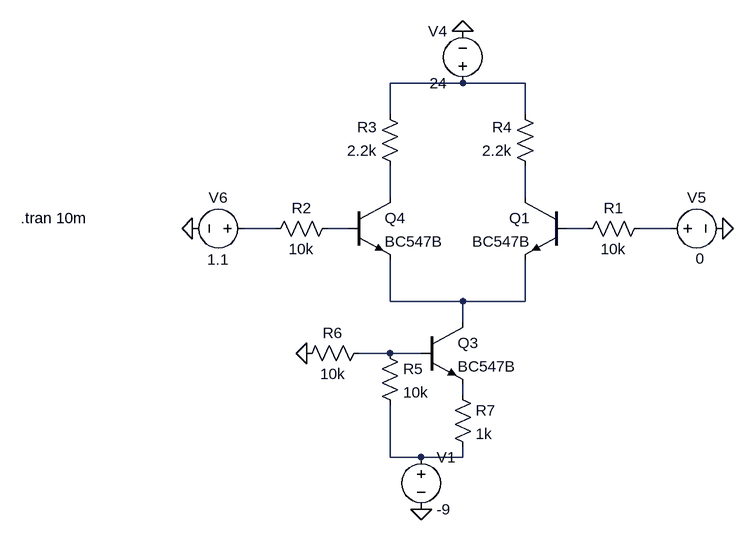
[diagram p0: schematic bjtDiffAmp.asc]
bjtDiffAmp.asc, the LTspice schematic file:
Version 4
SHEET 1 4284 2692
WIRE 3360 2016 3248 2016
WIRE 3456 2016 3360 2016
WIRE 3248 2064 3248 2016
WIRE 3456 2064 3456 2016
WIRE 3248 2192 3248 2144
WIRE 3456 2192 3456 2144
WIRE 3072 2240 3024 2240
WIRE 3184 2240 3152 2240
WIRE 3552 2240 3520 2240
WIRE 3680 2240 3632 2240
WIRE 3248 2352 3248 2288
WIRE 3360 2352 3248 2352
WIRE 3456 2352 3456 2288
WIRE 3456 2352 3360 2352
WIRE 3360 2384 3360 2352
WIRE 3248 2432 3200 2432
WIRE 3296 2432 3248 2432
WIRE 3360 2496 3360 2480
WIRE 3248 2592 3248 2512
WIRE 3296 2592 3248 2592
WIRE 3360 2592 3360 2576
WIRE 3360 2592 3296 2592
FLAG 3360 1936 0
FLAG 3760 2240 0
FLAG 3296 2672 0
FLAG 2944 2240 0
FLAG 3120 2432 0
SYMBOL res 3648 2224 R90
WINDOW 0 0 56 VBottom 2
WINDOW 3 32 56 VTop 2
SYMATTR InstName R1
SYMATTR Value 10k
SYMBOL res 3168 2224 R90
WINDOW 0 0 56 VBottom 2
WINDOW 3 32 56 VTop 2
SYMATTR InstName R2
SYMATTR Value 10k
SYMBOL res 3264 2160 R180
WINDOW 0 36 76 Left 2
WINDOW 3 36 40 Left 2
SYMATTR InstName R3
SYMATTR Value 2.2k
SYMBOL res 3472 2160 R180
WINDOW 0 36 76 Left 2
WINDOW 3 36 40 Left 2
SYMATTR InstName R4
SYMATTR Value 2.2k
SYMBOL npn 3296 2384 R0
SYMATTR InstName Q3
SYMATTR Value BC547B
SYMBOL res 3232 2416 R0
SYMATTR InstName R5
SYMATTR Value 10k
SYMBOL res 3216 2416 R90
WINDOW 0 0 56 VBottom 2
WINDOW 3 32 56 VTop 2
SYMATTR InstName R6
SYMATTR Value 10k
SYMBOL voltage 3296 2576 R0
WINDOW 123 0 0 Left 0
WINDOW 39 0 0 Left 0
SYMATTR InstName V1
SYMATTR Value -9
SYMBOL voltage 3360 2032 R180
WINDOW 0 24 96 Left 2
WINDOW 3 24 16 Left 2
WINDOW 123 0 0 Left 0
WINDOW 39 0 0 Left 0
SYMATTR InstName V4
SYMATTR Value 24
SYMBOL voltage 3664 2240 R270
WINDOW 0 32 56 VTop 2
WINDOW 3 -62 61 VTop 2
WINDOW 123 0 0 Left 0
WINDOW 39 0 0 Left 0
SYMATTR InstName V5
SYMATTR Value 0
SYMBOL voltage 3040 2240 R90
WINDOW 0 -32 56 VBottom 2
WINDOW 3 32 56 VTop 2
WINDOW 123 0 0 Left 0
WINDOW 39 0 0 Left 0
SYMATTR InstName V6
SYMATTR Value 1.1
SYMBOL res 3344 2480 R0
SYMATTR InstName R7
SYMATTR Value 1k
SYMBOL npn 3184 2192 R0
SYMATTR InstName Q4
SYMATTR Value BC547B
SYMBOL npn 3520 2192 M0
SYMATTR InstName Q1
SYMATTR Value BC547B
TEXT 2680 2224 Left 2 !.tran 10m

The netlist it stands for:
* bjtDiffAmp.asc
R1 N007 N006 10k
R2 N005 N004 10k
R3 N002 N001 2.2k
R4 N003 N001 2.2k
Q3 N008 N009 N010 0 BC547B
R5 N009 N011 10k
R6 N009 0 10k
V1 N011 0 -9
V4 N001 0 24
V5 N007 0 0
V6 N004 0 1.1
R7 N010 N011 1k
Q4 N002 N005 N008 0 BC547B
Q1 N003 N006 N008 0 BC547B
.model NPN NPN
.model PNP PNP
.lib standard.bjt
.tran 10m
.backanno
.end